# EAGLE design untitled (EAGLE 7.7.0)
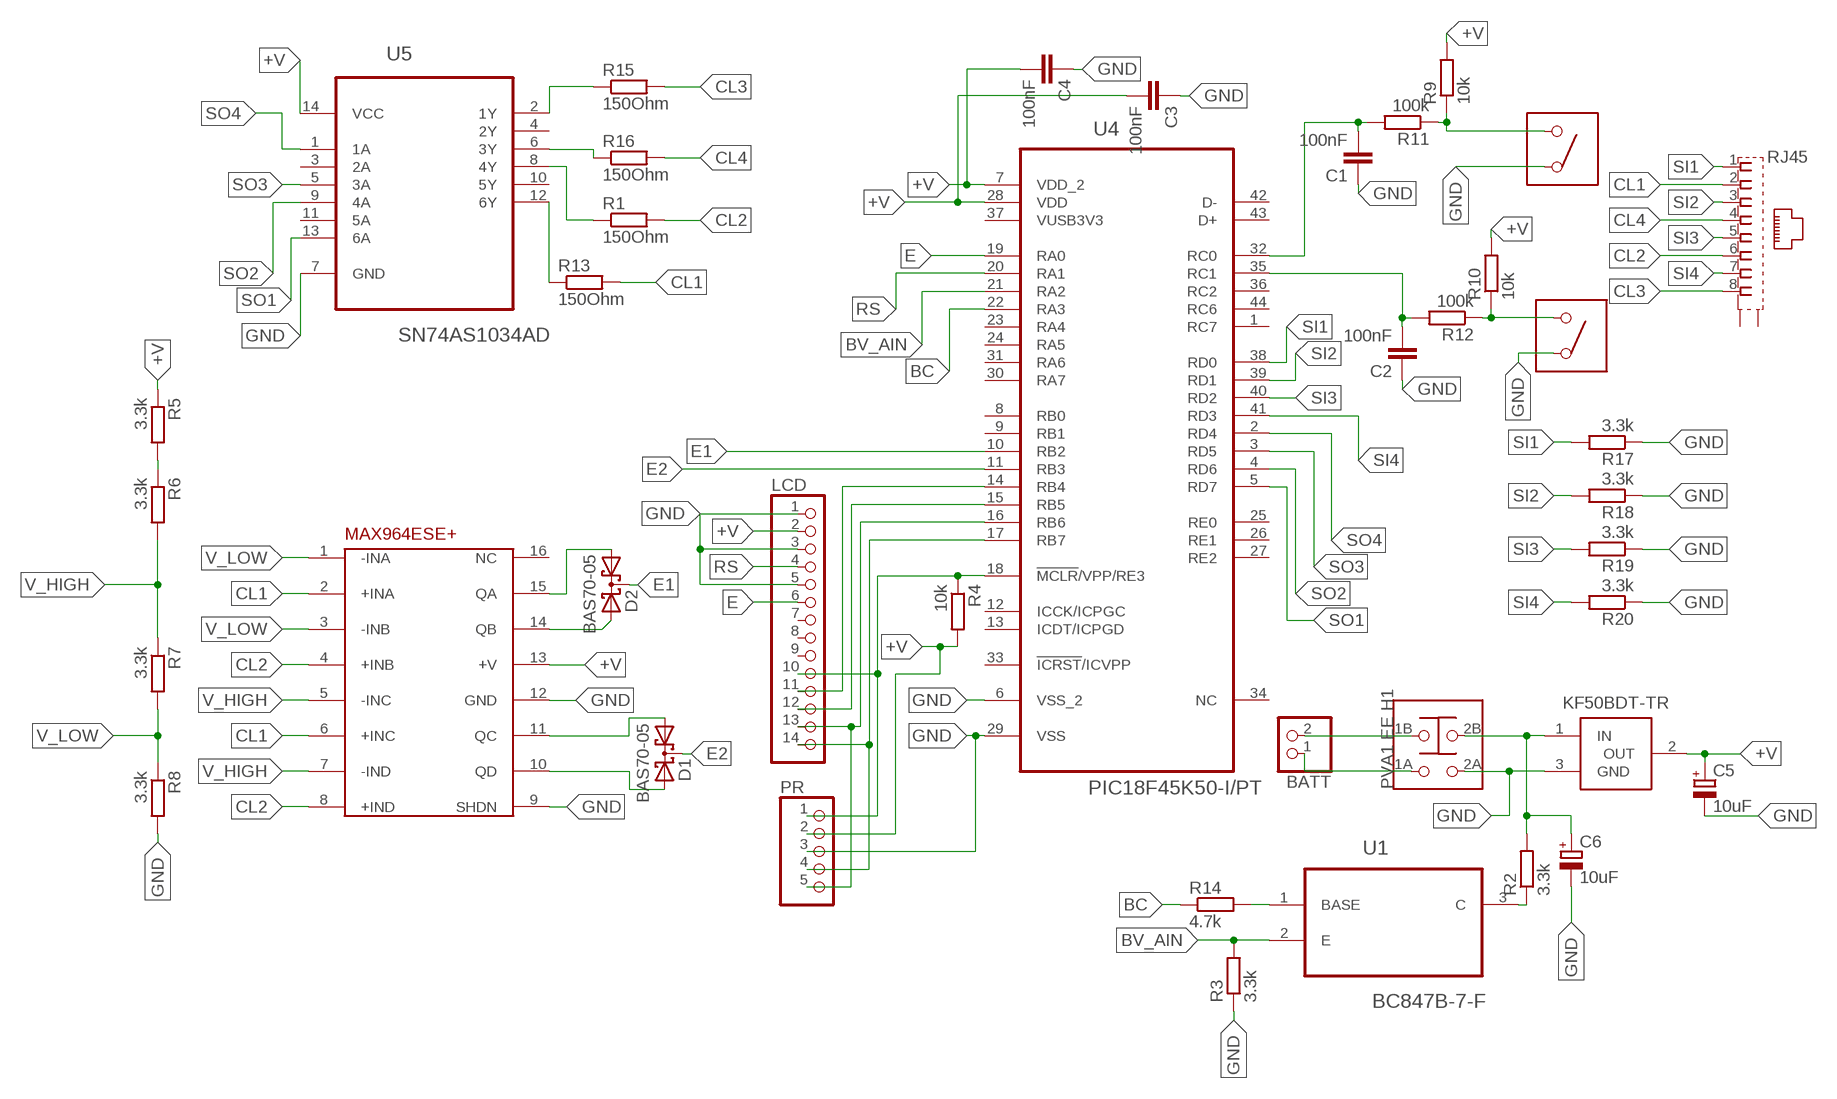
[diagram p0: schematic, sheet 1]

## Parts
BATT  PINHD-1X2  [1X02]
C1  100nF  C-EUC0603  [C0603]
C2  100nF  C-EUC0603  [C0603]
C3  100nF  C-EUC0603  [C0603]
C4  100nF  C-EUC0603  [C0603]
C5  10uF  CPOL-EU153CLV-0405  [153CLV-0405]
C6  10uF  CPOL-EU153CLV-0405  [153CLV-0405]
D1  BAS70-05  [SOT23]
D2  BAS70-05  [SOT23]
LCD  PINHD-1X14  [1X14]
PR  PINHD-1X5  [1X05]
R1  150Ohm  R-EU_R0603  [R0603]
R2  3.3k  R-EU_R0603  [R0603]
R3  3.3k  R-EU_R0603  [R0603]
R4  10k  R-EU_R0603  [R0603]
R5  3.3k  R-EU_R0603  [R0603]
R6  3.3k  R-EU_R0603  [R0603]
R7  3.3k  R-EU_R0603  [R0603]
R8  3.3k  R-EU_R0603  [R0603]
R9  10k  R-EU_R0603  [R0603]
R10  10k  R-EU_R0603  [R0603]
R11  100k  R-EU_R0603  [R0603]
R12  100k  R-EU_R0603  [R0603]
R13  150Ohm  R-EU_R0603  [R0603]
R14  4.7k  R-EU_R0603  [R0603]
R15  150Ohm  R-EU_R0603  [R0603]
R16  150Ohm  R-EU_R0603  [R0603]
R17  3.3k  R-EU_R0603  [R0603]
R18  3.3k  R-EU_R0603  [R0603]
R19  3.3k  R-EU_R0603  [R0603]
R20  3.3k  R-EU_R0603  [R0603]
RJ45  1-406541-6  [RJ45]
U1  BC847B-7-F  [SOT95P240X110-3N]
U4  PIC18F45K50-I/PT  [TQFP80P1200X1200X120-44N]
U5  SN74AS1034AD  [SOIC127P600X175-14N]
U$1  KF50BDT-TR  [TO252]
U$2  MAX964ESE+  [SO16]
U$3  PVA1_EE_H1  [PVA1_EE_H1]
U$4  FSM4JRT  [FSM4JRT]
U$5  FSM4JRT  [FSM4JRT]

## Nets
+V: C3.2 C4.2 C5.+ LCD.2 PR.2 R4.2 R5.1 R9.2 R10.2 U4.7(VDD_2) U4.28(VDD) U5.14(VCC) U$1.2(OUT) U$2.13(+V)
BC: R14.1 U4.22(RA3)
BV_AIN: R3.2 U1.2(E) U4.21(RA2)
CL1: R13.2 RJ45.2 U$2.2(+INA) U$2.6(+INC)
CL2: R1.2 RJ45.6 U$2.4(+INB) U$2.8(+IND)
CL3: R15.2 RJ45.8
CL4: R16.2 RJ45.4
E: LCD.6 U4.19(RA0)
E1: D2.3(C) U4.10(RB2)
E2: D1.3(C) U4.11(RB3)
GND: C1.1 C2.1 C3.1 C4.1 C5.- C6.- LCD.1 LCD.3 LCD.5 PR.3 R3.1 R8.2 R17.1 R18.1 R19.1 R20.1 U4.6(VSS_2) U4.29(VSS) U5.7(GND) U$1.3(GND) U$2.9(SHDN) U$2.12(GND) U$3.2A U$4.2 U$5.2
MCLR: LCD.10 PR.1 R4.1 U4.18(!MCLR!/VPP/RE3)
N$1: LCD.11 U4.14(RB4)
N$2: LCD.12 U4.15(RB5)
N$3: R14.2 U1.1(BASE)
N$4: R2.1 U1.3(C)
N$5: R1.1 U5.8(4Y)
N$6: R13.1 U5.12(6Y)
N$7: R16.1 U5.6(3Y)
N$8: LCD.13 PR.5 U4.16(RB6)
N$9: C1.2 R11.2 U4.32(RC0)
N$10: BATT.2 U$3.1B
N$11: R15.1 U5.2(1Y)
N$12: BATT.1 U$3.1A
N$13: LCD.14 PR.4 U4.17(RB7)
N$14: D2.1(A1) U$2.15(QA)
N$15: R5.2 R6.1
N$16: D2.2(A2) U$2.14(QB)
N$17: D1.1(A1) U$2.11(QC)
N$18: R9.1 R11.1 U$4.1
N$19: D1.2(A2) U$2.10(QD)
N$20: C2.2 R12.2 U4.35(RC1)
N$21: R10.1 R12.1 U$5.1
N$24: C6.+ R2.2 U$1.1(IN) U$3.2B
RS: LCD.4 U4.20(RA1)
SI1: R17.2 RJ45.1 U4.38(RD0)
SI2: R18.2 RJ45.3 U4.39(RD1)
SI3: R19.2 RJ45.5 U4.40(RD2)
SI4: R20.2 RJ45.7 U4.41(RD3)
SO1: U4.5(RD7) U5.13(6A)
SO2: U4.4(RD6) U5.9(4A)
SO3: U4.3(RD5) U5.5(3A)
SO4: U4.2(RD4) U5.1(1A)
V_HIGH: R6.2 R7.1 U$2.5(-INC) U$2.7(-IND)
V_LOW: R7.2 R8.1 U$2.1(-INA) U$2.3(-INB)
Unconnected: LCD.7 LCD.8 LCD.9 RJ45.S1 RJ45.S2 U4.1(RC7) U4.8(RB0) U4.9(RB1) U4.12(ICCK/ICPGC) U4.13(ICDT/ICPGD) U4.23(RA4) U4.24(RA5) U4.25(RE0) U4.26(RE1) U4.27(RE2) U4.30(RA7) U4.31(RA6) U4.33(!ICRST!/ICVPP) U4.34(NC) U4.36(RC2) U4.42(D-) U4.43(D+) U4.44(RC6) U5.3(2A) U5.4(2Y) U5.10(5Y) U5.11(5A) U$2.16(NC)

## Power pins joined to a net without a drawn wire
VUSB3V3: U4.37(VUSB3V3)

## Library data of the parts
BATT = pinhead:PINHD-1X2: PIN HEADER; OC_FARNELL: unknown
C1-C4 = resistor:C-EU: CAPACITOR, European symbol; MF: YAGEO (PHYCOMP); MPN: CC0603KRX7R7BB104; OC_FARNELL: 432210
C5 C6 = rcl:CPOL-EU: POLARIZED CAPACITOR, European symbol; MF: RUBYCON; MPN: 16TZV10M4X6.1; OC_FARNELL: 2346364
D1 D2 = diode:BAS70-05: Silicon Schottky Diodes General-purpose diode for high-speed switching
LCD = pinhead:PINHD-1X14: PIN HEADER; OC_FARNELL: unknown
PR = pinhead:PINHD-1X5: PIN HEADER; OC_FARNELL: unknown
R1 R13 R15 R16 = resistor:R-EU_: RESISTOR, European symbol; MF: TE CONNECTIVITY / NEOHM; MPN: CPF0603F150RC1; OC_FARNELL: 1527376
R2 R3 R5-R8 R17-R20 = resistor:R-EU_: RESISTOR, European symbol; MF: TE CONNECTIVITY; MPN: CRGH0603F3K3; OC_FARNELL: 2332009
R4 R9 R10 = resistor:R-EU_: RESISTOR, European symbol; MF: VISHAY; MPN: CRCW060310K0FKTA; OC_FARNELL: 1652827
R11 R12 = resistor:R-EU_: RESISTOR, European symbol; MF: TE CONNECTIVITY; MPN: CRGH0603J100K; OC_FARNELL: 2331753
R14 = resistor:R-EU_: RESISTOR, European symbol; MF: VISHAY; MPN: CRCW06034K70FKEA; OC_FARNELL: 1469807
RJ45 = my_connector:1-406541-6: MODULAR, JACK, RJ45, THT, 8P8C; MF: AMP - TE CONNECTIVITY; MPN: 1-406541-6; OC_FARNELL: 2310179
U1 = Diodes:BC847B-7-F: SIGNAL TRANSISTOR; MF: DIODES INC.; MPN: BC847B-7-F; OC_FARNELL: 1773608; OC_NEWARK: 51R6391; PACKAGE: SOT-23-3; SUPPLIER: DIODES INC.
U4 = PIC18F45k50:PIC18F45K50-I/PT: IC, MCU, 8BIT, 32KB FLASH, 44TQFP; MF: MICROCHIP; MPN: PIC18F45K50-I/PT; OC_FARNELL: 2305837; OC_NEWARK: 06W2983; PACKAGE: 44TQFP; SUPPLIER: Microchip
U5 = texas:SN74AS1034AD: HEX DRIVERS; MF: TEXAS INSTRUMENTS; MPN: SN74AS1034AD; OC_FARNELL: 1470728; OC_NEWARK: 08F6150; PACKAGE: SOIC-14; SUPPLIER: Texas Instruments
U$1 = st-microelectronics:KF50BDT-TR: Fixed LDO Voltage Regulator, 7V to 20V, 400mV Dropout, 5Vout, 500mAout, TO-252-3; MF: STMICROELECTRONICS; MPN: KF50BDT-TR; OC_FARNELL: 1467757
U$2 = maxim:MAX964ESE+: Analogue Comparator, Quad, High Speed, 4, 7 ns, 5V to 10V, SOIC, 16 Pins; MF: MAXIM INTEGRATED PRODUCTS; MPN: MAX964ESE+; OC_FARNELL: 2518928
U$3 = con-ck-components:PVA1_EE_H1: PVA1 EE H1 3.5N V2 Pushbutton Switch, DPST, Push On-Push Off, 32 V, 100 mA, Through Hole C & K COMPONENTS; MF: C & K COMPONENTS; MPN: PVA1 EE H1 3.5N V2; OC_FARNELL: 2435325
U$4 U$5 = con-te-connectivity:FSM4JRT: FSM4JRT Tactile Switch, Non Illuminated, 24 V, 50 mA, 160 gf, Through Hole, FSMJRT Series TE CONNECTIVITY / ALCOSWITCH; MF: TE CONNECTIVITY / ALCOSWITCH; MPN: FSM4JRT; OC_FARNELL: 2396052

## Net classes
0 default: width 0.381 mm, drill 0.8 mm, clearance 0.279 mm

## Board
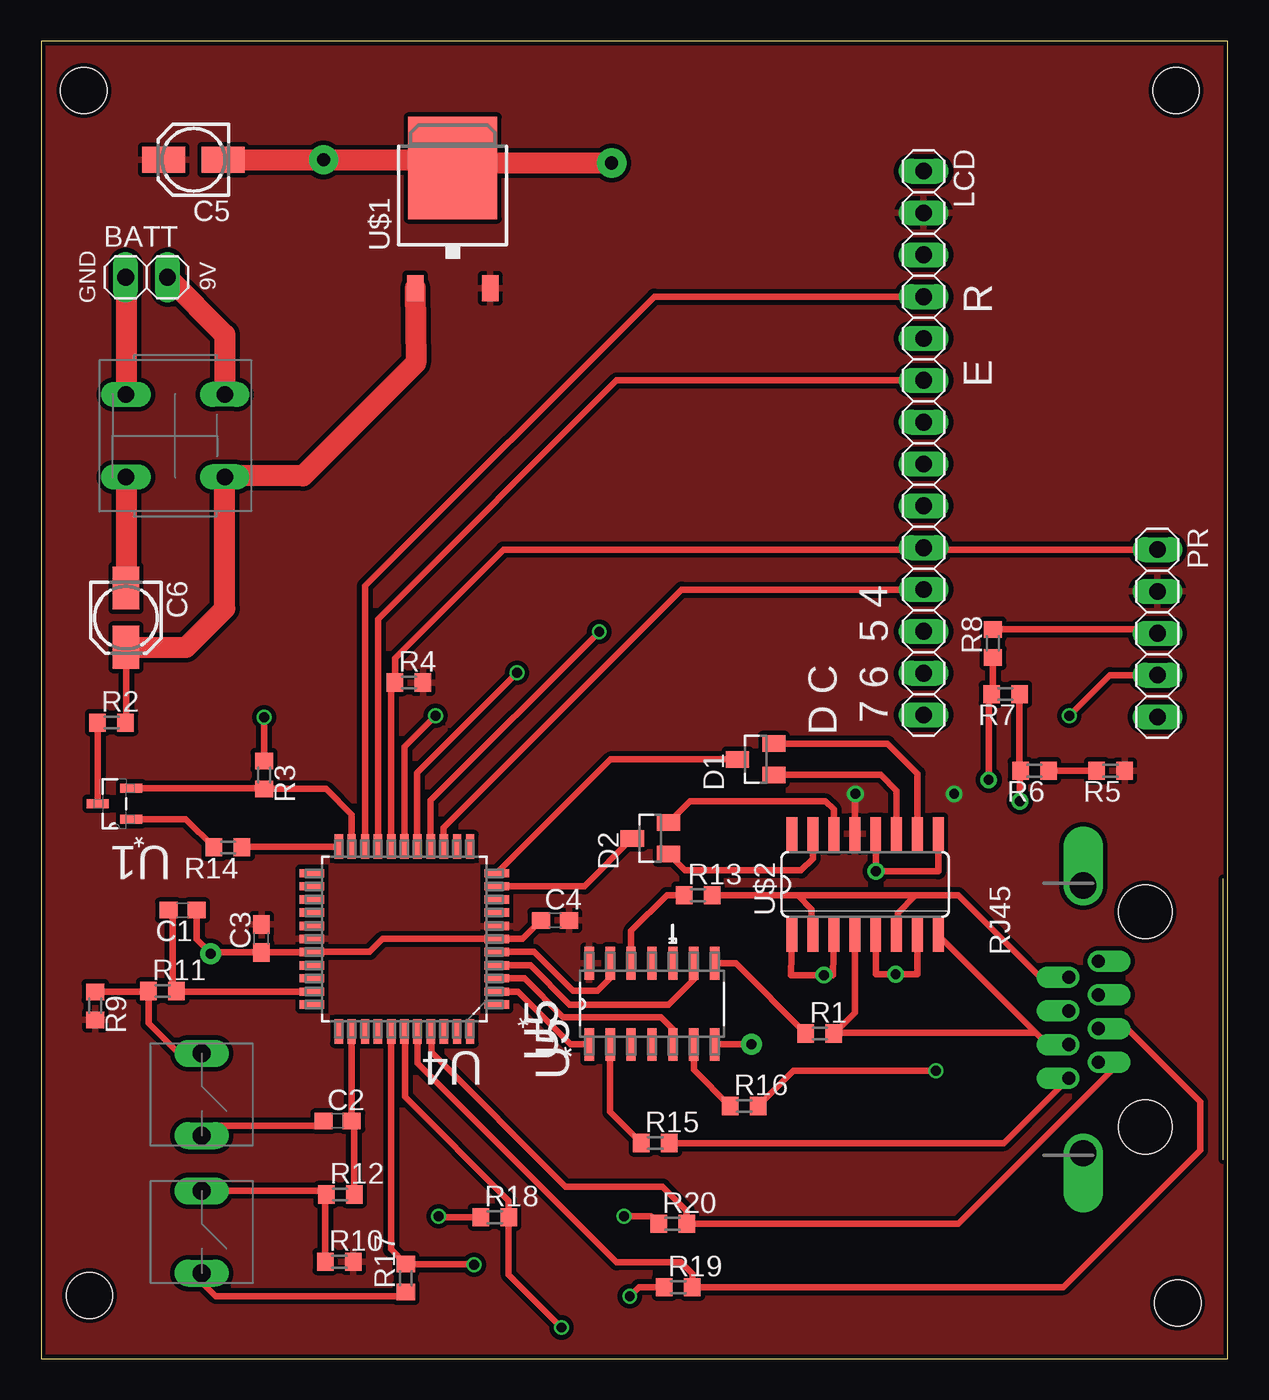
[diagram p1: board, top side]
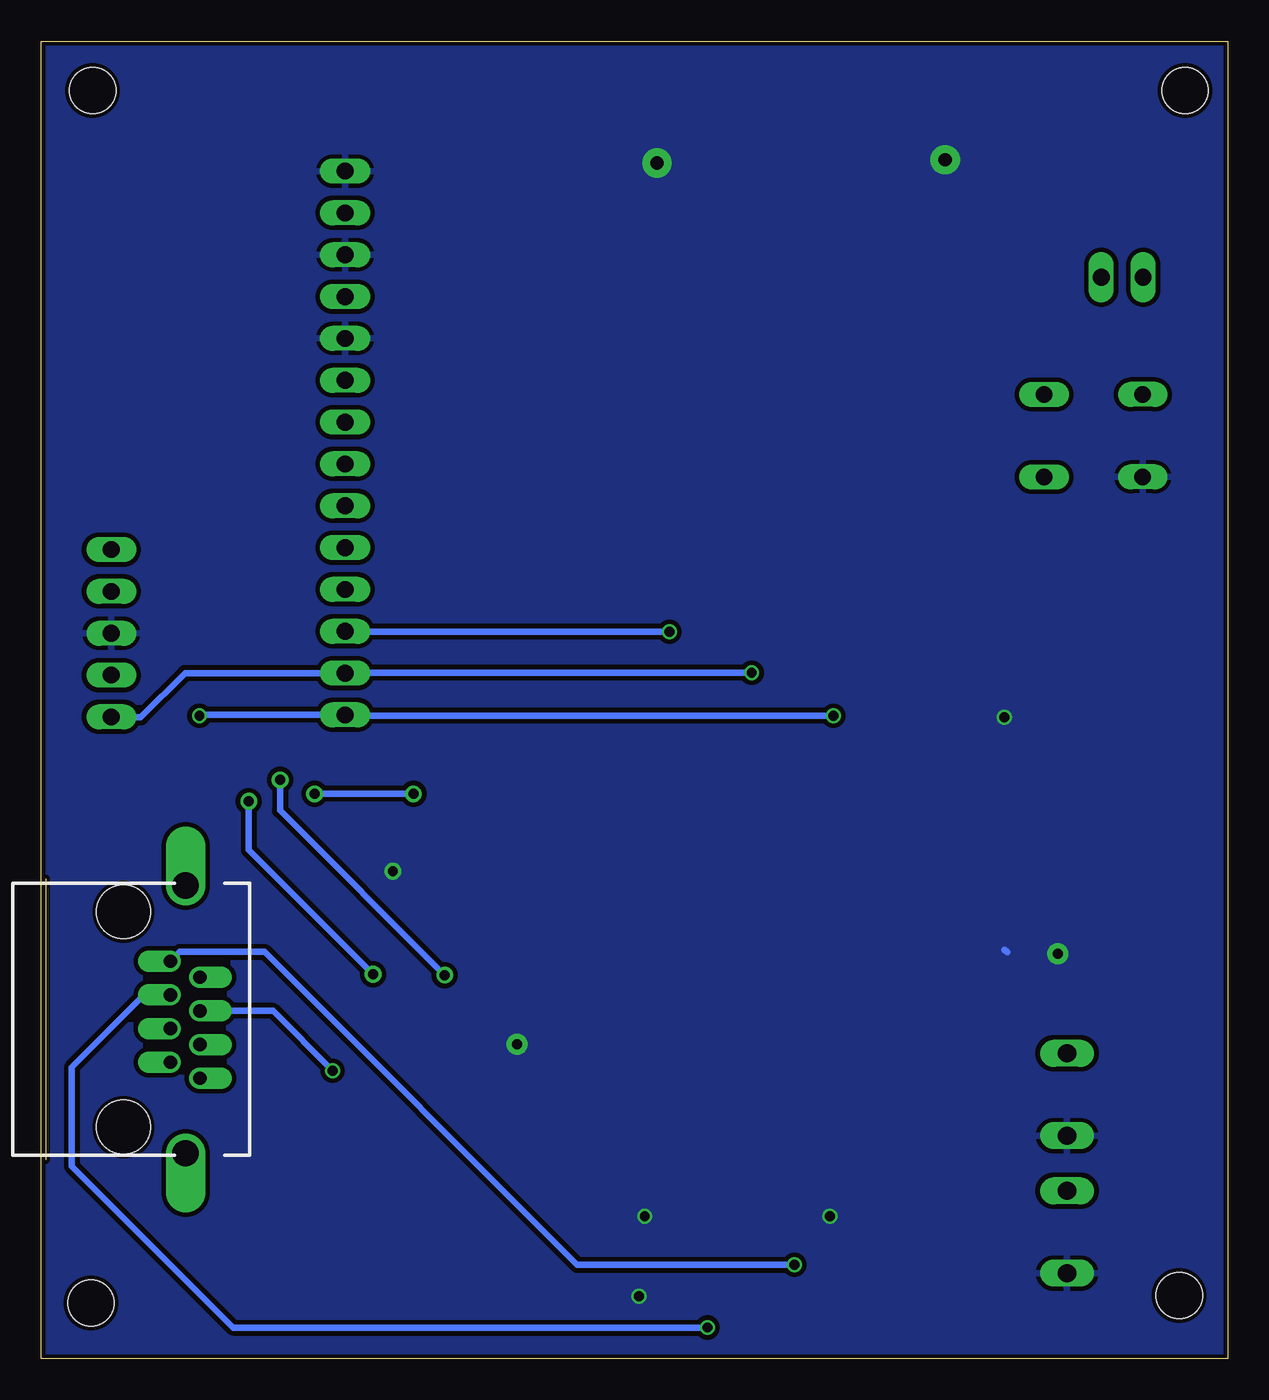
[diagram p2: board, bottom side, seen from below]

Size 72.06 x 80 mm. Coordinates in mm from the lower left corner, seen from the top.
Outline: 0,0 72.06,0 72.06,80 0,80 0,0
Copper layers (1*16): Top 0.035mm / dielectric 1.5mm / Bottom 0.035mm
Design rules "SeeedStudio_2layer_DRU_no_angle_20140221": minimum track width 6mil, minimum drill 12mil, track to track 6mil, track to pad 6mil, pad to pad 6mil, via to via 6mil, smd to smd 0mil, copper to edge 10mil, drill to drill 10mil, minimum pad ring 10mil, minimum via ring 6mil, stop-mask expansion 2mil, vias tented up to drill 100mil, thermal gap 10mil
Holes 2.8 mm at 2.94,3.84 2.59,77 68.93,77 69.03,3.39

### Footprints (pad centres in the part's own frame; a part is rotated, then mirrored left to right if it is on the bottom)
1X02 = drill 1.016 long: 1 -1.27,0; 2 1.27,0
C0603 = smd 1.1 x 1: 1 -0.85,0; 2 0.85,0
153CLV-0405 = smd 2.6 x 1.6: + 1.8,0; - -1.8,0
SOT23 = smd 1 x 1.4: 1 -0.95,-1.1; 2 0.95,-1.1; 3 0,1.1
1X14 = drill 1.016 long: 1 -16.51,0; 2 -13.97,0; 3 -11.43,0; 4 -8.89,0; 5 -6.35,0; 6 -3.81,0; 7 -1.27,0; 8 1.27,0; 9 3.81,0; 10 6.35,0; 11 8.89,0; 12 11.43,0; 13 13.97,0; 14 16.51,0
1X05 = drill 1.016 long: 1 -5.08,0; 2 -2.54,0; 3 0,0; 4 2.54,0; 5 5.08,0
R0603 = smd 1 x 1.1: 1 -0.85,0; 2 0.85,0
RJ45 = drill 0.8 pad 1.15 offset: 1 -3.52,-3.05; 2 -2.55,-4.84; 3 -1.48,-3.05; 4 -0.51,-4.84; 5 0.56,-3.05; 6 1.53,-4.84; 7 2.6,-3.05; 8 3.57,-4.84 | drill 1.6 pad 2.184 offset: S1 -8.125,-3.97; S2 8.125,-3.97 | hole 3.25: -6.54,-0.2; 6.54,-0.2
SOT95P240X110-3N = smd 1.321 x 0.559: 1 -1.016,0.94; 2 -1.016,-0.94; 3 1.016,0
TQFP80P1200X1200X120-44N = smd 1.473 x 0.508: 1 -5.613,3.988; 2 -5.613,3.2; 3 -5.613,2.388; 4 -5.613,1.6; 5 -5.613,0.787; 6 -5.613,0; 7 -5.613,-0.787; 8 -5.613,-1.6; 9 -5.613,-2.388; 10 -5.613,-3.2; 11 -5.613,-3.988; 23 5.613,-3.988; 24 5.613,-3.2; 25 5.613,-2.388; 26 5.613,-1.6; 27 5.613,-0.787; 28 5.613,0; 29 5.613,0.787; 30 5.613,1.6; 31 5.613,2.388; 32 5.613,3.2; 33 5.613,3.988 | smd 0.508 x 1.473: 12 -3.988,-5.613; 13 -3.2,-5.613; 14 -2.388,-5.613; 15 -1.6,-5.613; 16 -0.787,-5.613; 17 0,-5.613; 18 0.787,-5.613; 19 1.6,-5.613; 20 2.388,-5.613; 21 3.2,-5.613; 22 3.988,-5.613; 34 3.988,5.613; 35 3.2,5.613; 36 2.388,5.613; 37 1.6,5.613; 38 0.787,5.613; 39 0,5.613; 40 -0.787,5.613; 41 -1.6,5.613; 42 -2.388,5.613; 43 -3.2,5.613; 44 -3.988,5.613
SOIC127P600X175-14N = smd 1.981 x 0.559: 1 -2.464,3.81; 2 -2.464,2.54; 3 -2.464,1.27; 4 -2.464,0; 5 -2.464,-1.27; 6 -2.464,-2.54; 7 -2.464,-3.81; 8 2.464,-3.81; 9 2.464,-2.54; 10 2.464,-1.27; 11 2.464,0; 12 2.464,1.27; 13 2.464,2.54; 14 2.464,3.81
TO252 = smd 1 x 1.6: 1 -2.28,-4.8; 2 2.28,-4.8 | smd 5.4 x 6.2: 3 0,2.5
SO16 = smd 0.66 x 2.032: 1 -4.445,-3.073; 2 -3.175,-3.073; 3 -1.905,-3.073; 4 -0.635,-3.073; 5 0.635,-3.073; 6 1.905,-3.073; 7 3.175,-3.073; 8 4.445,-3.073; 9 4.445,3.073; 10 3.175,3.073; 11 1.905,3.073; 12 0.635,3.073; 13 -0.635,3.073; 14 -1.905,3.073; 15 -3.175,3.073; 16 -4.445,3.073
PVA1_EE_H1 = drill 1 pad 1.27 long: 1A -3,2.5; 1B 3,2.5; 2A -3,-2.5; 2B 3,-2.5
FSM4JRT = drill 1.1 pad 1.27 long: 1 0,2.5; 2 0,-2.5

### Placement (x,y rotation side)
BATT  6.4,65.67 0 top
C1  8.59,27.24 180 top
C2  18.01,14.44 0 top
C3  13.38,25.52 90 top
C4  31.21,26.62 0 top
C5  9.25,72.8 180 top
C6  5.15,45 270 top
D1  43.4,36.4 90 top
D2  37,31.6 90 top
LCD  53.6,55.6 270 top
PR  67.8,44.05 270 top
R1  47.3,19.75 0 top
R2  4.28,38.63 0 top
R3  13.54,35.45 270 top
R4  22.34,41.06 0 top
R5  64.96,35.71 180 top
R6  60.33,35.71 180 top
R7  58.57,40.36 180 top
R8  57.81,43.44 90 top
R9  3.28,21.43 270 top
R10  18.11,5.9 0 top
R11  7.38,22.33 0 top
R12  18.16,9.98 0 top
R13  39.9,28.15 0 top
R14  11.35,31.05 180 top
R15  37.3,13.1 0 top
R16  42.7,15.35 0 top
R17  22.15,4.9 90 top
R18  27.55,8.6 0 top
R19  38.7,4.35 0 top
R20  38.35,8.2 0 top
RJ45  67.26,20.61 270 top
U1  4.45,33.7 180 top
U4  22.06,25.49 180 top
U5  37.1,21.55 90 top
U$1  25,69.8 0 top
U$2  50.05,28.8 0 top
U$3  8.15,56.05 0 top
U$4  9.75,16.05 0 top
U$5  9.75,7.7 0 top

### Tracks (layer width: path | path; a pad name or v marks a point on that pad's centre or on a via)
+V  (via drill 0.6 pad 1.02)
  Top 0.406: U$2.13 49.41,33.87 v49.45,34.3
  Bottom 0.406: v49.45,34.3 v55.45,34.3
  pour Top: -1.37,81 -1.27,-1.27 73.66,-1.27 73.56,81
BC
  Top 0.406: U4.22 12.25,31.1 R14.1
BV_AIN
  Top 0.406: U4.21 18.86,33.04 17.3,34.6 R3.2 13.5,34.64 U1.2
CL1
  Top 0.406: R13.2 45.95,28.15 | 45.95,28.15 46.8,27.3 46.8,25.8 U$2.2 46.9,25.75 | RJ45.2 60.69,23.16 55.7,28.15 53.1,28.15 | U$2.6 52.05,25.82 52.05,27.05 53.1,28.15 | 53.1,28.15 45.95,28.15
CL2
  Top 0.406: RJ45.6 61.14,19.08 60.42,19.8 | 60.42,19.8 U$2.8 | 60.42,19.8 48.1,19.8 R1.2 49.41,21.02 U$2.4
CL3
  Top 0.406: R15.2 58.48,13.1 RJ45.8
CL4  (via drill 0.6)
  Top 0.406: R16.2 45.7,17.5 v54.35,17.5
  Bottom 0.406: v54.35,17.5 57.97,21.12 RJ45.4
E
  Top 0.406: U4.19 20.46,44.91 34.96,59.41 LCD.6 53.54,59.35
E1
  Top 0.406: D2.3 32.99,28.69 U4.10
E2
  Top 0.406: D1.3 34.6,36.4 U4.11
GND  (via drill 0.6, 0.6 pad 1.02, 0.6 pad 1.27, 0.8 pad 1.78)
  Top 0.406: U$2.9 54.49,29.6 v50.7,29.6 50.7,31.87 U$2.12 | C4.1 29.23,25.49 U4.6 20.75,25.5 19.95,24.7 U4.29 16.45,24.67 C3.1 10.3,24.67 v10.3,24.6 9.44,25.46 C1.1 | R18.1 24.2,8.6 v24.15,8.65 | R3.1 v13.54,38.94 v13.55,38.95 | 53.65,61.9 LCD.5 | R8.2 67.8,44.29 PR.3 | R19.1 36.3,4.35 v35.75,3.8 | U5.7 43.14,19.09 v43.15,19.1 | R20.1 37.05,8.65 v35.4,8.65 | C2.1 16.87,14.15 10.2,14.15 9.75,13.7 U$4.2 | R17.1 21.9,3.8 10.6,3.8 9.75,4.65 U$5.2
  Top 1.27: U$3.2A C6.- | C5.- v17.15,72.8 24.5,72.8 U$1.3 | v34.65,72.6 25.15,72.6 25.15,72.4
  Bottom 0.406: 13.55,24.84 C3.1
  pour Bottom: -1.37,81 -1.27,-1.27 73.66,-1.27 73.56,81
MCLR
  Top 0.406: U4.18 21.24,31.17 21.24,40.76 R4.1 21.49,42.54 28.08,49.13 53.6,49.13 | PR.1 53.6,49.13 | 53.6,49.13 LCD.10
N$1
  Top 0.406: U4.14 24.45,32.25 38.9,46.7 LCD.11
N$2  (via drill 0.6)
  Top 0.406: U4.15 23.66,33.91 v33.9,44.15
  Bottom 0.406: v33.9,44.15 53.58,44.15 LCD.12
N$3
  Top 0.406: U1.1 8.79,32.76 R14.2
N$4
  Top 0.406: R2.1 U1.3
N$5
  Top 0.406: U5.8 42.19,24.01 R1.1
N$6
  Top 0.406: U5.12 35.83,25.98 38,28.15 R13.1
N$7
  Top 0.406: U5.6 39.64,17.56 R16.1
N$8  (via drill 0.6)
  Top 0.406: U4.16 22.85,35.6 v28.9,41.65
  Bottom 0.406: 67.72,39.05 PR.5 67.78,38.95 66,38.95 63.32,41.63 LCD.13 53.58,41.65 v28.9,41.65
N$9
  Top 0.406: U4.32 8.23,22.29 R11.2 8,22.56 8,26.8 7.74,27.06 C1.2
N$10
  Top 1.27: BATT.2 11.15,62.19 U$3.1B
N$11
  Top 0.406: U5.2 34.56,14.99 R15.1
N$12
  Top 1.27: BATT.1 5.15,65.67 U$3.1A
N$13  (via drill 0.6)
  Top 0.406: U4.17 22.06,37.16 v23.95,39.05 | v62.45,39.05 64.91,41.51 PR.4
  Bottom 0.406: LCD.14 | v23.95,39.05 53.56,39.05 LCD.14 | LCD.14 62.41,39.09 v62.45,39.05
N$14
  Top 0.406: D2.1 39.1,29.65 46.15,29.65 46.88,30.38 U$2.15
N$15
  Top 0.406: R6.1 R5.2
N$16
  Top 0.406: U$2.14 48.15,33.35 47.65,33.85 39.4,33.85 D2.2
N$17
  Top 0.406: U$2.11 51.95,34.49 51,35.45 D1.1
N$18
  Top 0.406: R9.1 6.48,22.28 R11.1 6.53,20.37 8.35,18.55 U$4.1
N$19
  Top 0.406: U$2.10 53.23,35.52 51.4,37.35 D1.2
N$20
  Top 0.406: U4.35 C2.2 | C2.2 | R12.2 19.01,14.29 C2.2
N$21
  Top 0.406: U$5.1 17.09,10.2 R12.1 17.26,9.93 R10.1
N$24
  Top 0.406: C6.+ 5.15,38.65 R2.2
  Top 1.27: C6.+ 8.8,43.2 11.15,45.55 U$3.2B 11.2,53.6 15.9,53.6 22.77,60.47 U$1.1
RS
  Top 0.406: U4.20 19.67,46.92 37.24,64.49 LCD.4 53.54,64.55
SI1  (via drill 0.6)
  Top 0.406: U4.38 21.25,19.85 21.25,6.65 R17.2 26.25,5.75 v26.3,5.7
  Bottom 0.406: RJ45.1 63.64,24.7 58.5,24.7 39.5,5.7 v26.3,5.7
SI2  (via drill 0.6)
  Top 0.406: v31.6,1.9 28.4,5.1 R18.2 28.4,9.6 22.1,15.9 22.1,19.84 U4.39
  Bottom 0.406: RJ45.3 65.81,22.09 70.2,17.7 70.2,11.7 60.4,1.9 v31.6,1.9
SI3
  Top 0.406: RJ45.5 64.26,20 66,20 70.4,15.6 70.4,12.65 62.1,4.35 R19.2 39.55,5.15 38.85,5.85 34.95,5.85 22.85,17.95 U4.40
SI4
  Top 0.406: RJ45.7 64.42,17.8 65.3,17.8 55.7,8.2 R20.2 39.2,9 37.75,10.45 31.85,10.45 23.7,18.6 23.7,19.84 U4.41
SO1
  Top 0.406: U4.5 29.95,24.7 32.3,22.35 33.8,22.35 34.55,23.1 U5.13
SO2
  Top 0.406: U5.9 39.65,23.05 38.1,21.5 32.1,21.5 29.71,23.89 U4.4
SO3
  Top 0.406: U4.3 29.35,23.1 31.7,20.75 37.65,20.75 38.45,19.95 38.45,19.17 U5.5
SO4
  Top 0.406: U4.2 28.96,22.29 32.15,19.1 33.28,19.1 U5.1
V_HIGH  (via drill 0.6 pad 1.02)
  Top 0.406: U$2.7 53.23,23.35 v51.9,23.35 50.7,23.35 50.7,25.73 U$2.5 | R7.1 59.42,35.71 R6.2 59.45,35.71 v59.45,33.85
  Bottom 0.406: v59.45,33.85 59.45,30.9 v51.9,23.35
V_LOW  (via drill 0.6 pad 1.02)
  Top 0.406: U$2.1 45.55,23.3 v47.55,23.3 48.1,23.3 U$2.3 | v57.55,35.15 57.55,40.19 R7.2 57.81,40.45 R8.1
  Bottom 0.406: v57.55,35.15 57.55,33.3 v47.55,23.3

### Text on the board
tNames: 9V | GND | E R | 7 6 5 4 | D C
tDocu: C D GND +V MC